# Altium schematic sheet THREE_PHASE_MODULE.SchDoc
size 457 x 304 mm; PageSetup: Record=PageOptions|CenterHorizontal=True|CenterVertical=True|PrintScale=0.68|XCorrection=1.00|YCorrection=1.00|PrintKind=1|BorderSize=5000000|LeftOffset=0|BottomOffset=0|Orientation=2|PaperLength=1000|PaperWidth=1000|Scale=100|PaperSource=7|PrintQuality=600|MediaType=1|DitherType=10|PaperKind=A4|PrintScaleMode=1
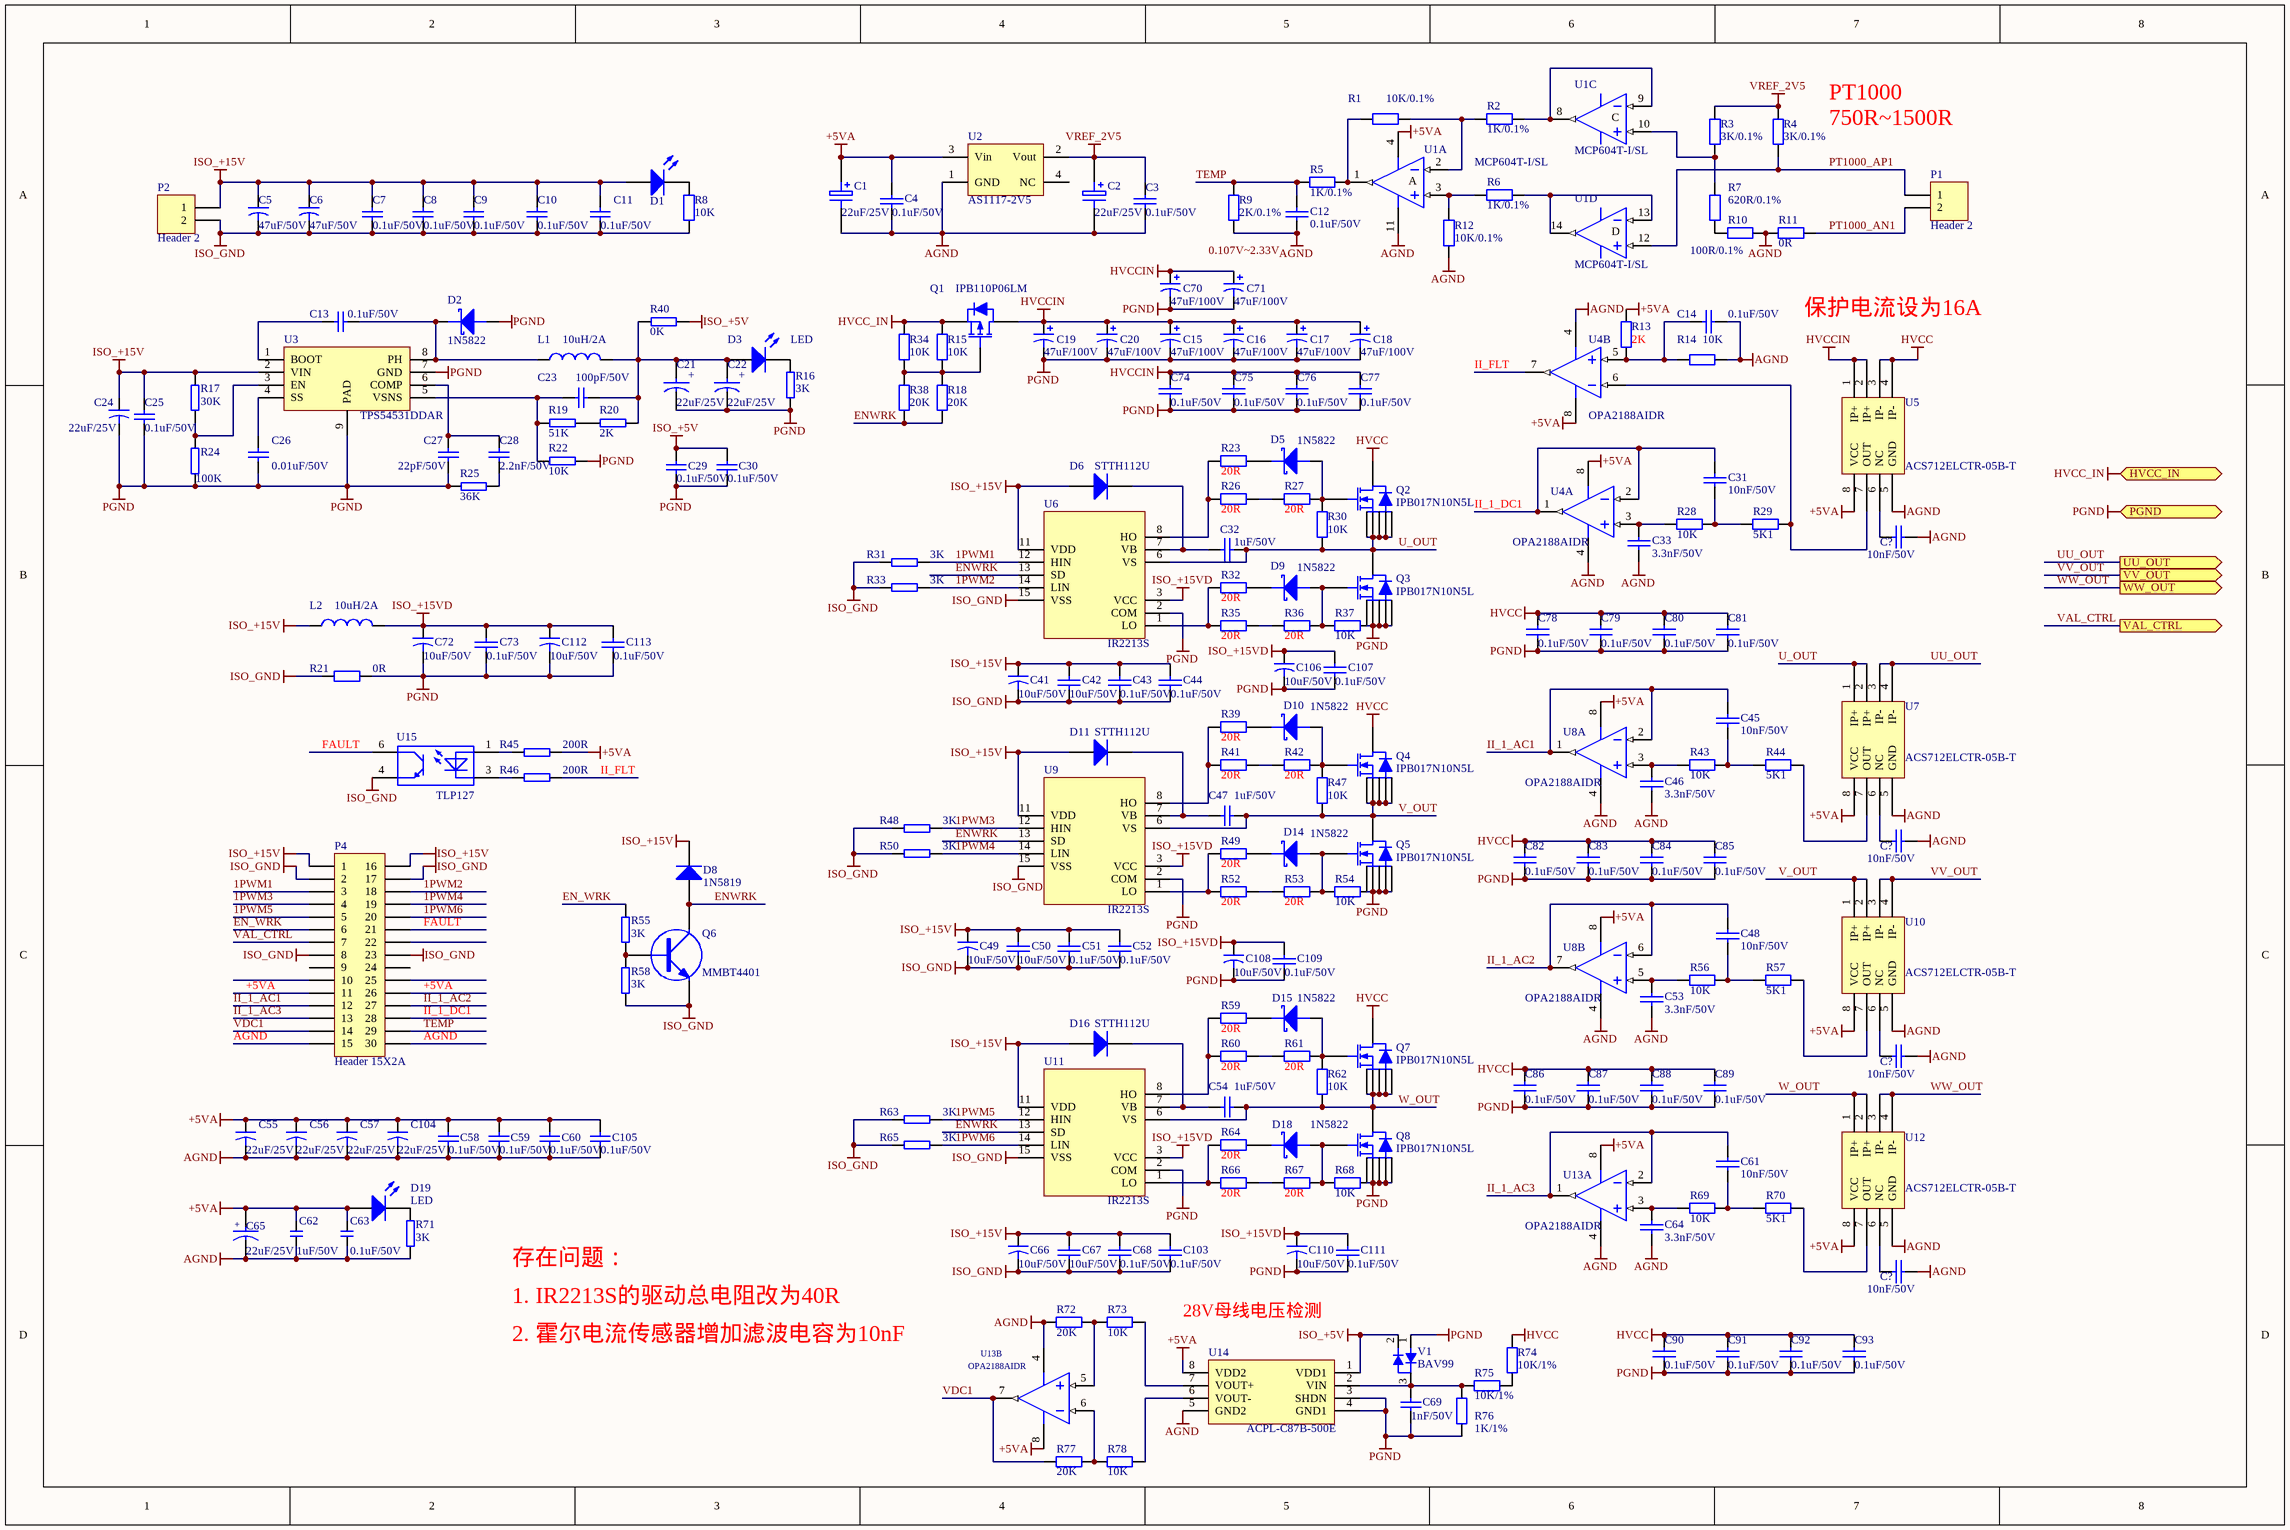
[diagram p0: THREE_PHASE_MODULE.SchDoc]

## Parts
(Parts that share a designator on the sheet are numbered #1, #2 ... from top to bottom, then left to right.)
C1  22uF/25V  [WP_1206CC]
C2  22uF/25V  [WP_1206CC]
C3  0.1uF/50V  [WP_0805C]
C4  0.1uF/50V  [WP_0805C]
C5  47uF/50V  [WP_1210CC]
C6  47uF/50V  [WP_1210CC]
C7  0.1uF/50V  [WP_0805C]
C8  0.1uF/50V  [WP_0805C]
C9  0.1uF/50V  [WP_0805C]
C10  0.1uF/50V  [WP_0805C]
C11  0.1uF/50V  [WP_0805C]
C12  0.1uF/50V  [WP_0805C]
C13  0.1uF/50V  [WP_0805C]
C14  0.1uF/50V  [WP_0805C]
C15  47uF/100V  [WP_1210CC]
C16  47uF/100V  [WP_1210CC]
C17  47uF/100V  [WP_1210CC]
C18  47uF/100V  [WP_1210CC]
C19  47uF/100V  [WP_1210CC]
C20  47uF/100V  [WP_1210CC]
C21  22uF/25V  [WP_1206CC]
C22  22uF/25V  [WP_1206CC]
C23  100pF/50V  [WP_0805C]
C24  22uF/25V  [WP_1206CC]
C25  0.1uF/50V  [WP_0805C]
C26  0.01uF/50V  [WP_0805C]
C27  22pF/50V  [WP_0805C]
C28  2.2nF/50V  [WP_0805C]
C29  0.1uF/50V  [WP_0805C]
C30  0.1uF/50V  [WP_0805C]
C31  10nF/50V  [WP_0805C]
C32  1uF/50V  [WP_0805C]
C33  3.3nF/50V  [WP_0805C]
C41  10uF/50V  [WP_1206CC]
C42  10uF/50V  [WP_1206CC]
C43  0.1uF/50V  [WP_0805C]
C44  0.1uF/50V  [WP_0805C]
C45  10nF/50V  [WP_0805C]
C46  3.3nF/50V  [WP_0805C]
C47  value 1uF/50V  [WP_0805C]  (hidden comment: Cap Semi)
C48  10nF/50V  [WP_0805C]
C49  10uF/50V  [WP_1206CC]
C50  10uF/50V  [WP_1206CC]
C51  0.1uF/50V  [WP_0805C]
C52  0.1uF/50V  [WP_0805C]
C53  3.3nF/50V  [WP_0805C]
C54  value 1uF/50V  [WP_0805C]  (hidden comment: Cap Semi)
C55  22uF/25V  [WP_1206CC]
C56  22uF/25V  [WP_1206CC]
C57  22uF/25V  [WP_1206CC]
C58  0.1uF/50V  [WP_0805C]
C59  0.1uF/50V  [WP_0805C]
C60  0.1uF/50V  [WP_0805C]
C61  10nF/50V  [WP_0805C]
C62  1uF/50V  [WP_0805C]
C63  0.1uF/50V  [WP_0805C]
C64  3.3nF/50V  [WP_0805C]
C65  22uF/25V  [WP_1206CC]
C66  10uF/50V  [WP_1206CC]
C67  10uF/50V  [WP_1206CC]
C68  0.1uF/50V  [WP_0805C]
C69  1nF/50V  [WP_0805C]
C70  47uF/100V  [WP_1210CC]
C71  47uF/100V  [WP_1210CC]
C72  10uF/50V  [WP_1206CC]
C73  0.1uF/50V  [WP_0805C]
C74  0.1uF/50V  [WP_0805C]
C75  0.1uF/50V  [WP_0805C]
C76  0.1uF/50V  [WP_0805C]
C77  0.1uF/50V  [WP_0805C]
C78  0.1uF/50V  [WP_0805C]
C79  0.1uF/50V  [WP_0805C]
C80  0.1uF/50V  [WP_0805C]
C81  0.1uF/50V  [WP_0805C]
C82  0.1uF/50V  [WP_0805C]
C83  0.1uF/50V  [WP_0805C]
C84  0.1uF/50V  [WP_0805C]
C85  0.1uF/50V  [WP_0805C]
C86  0.1uF/50V  [WP_0805C]
C87  0.1uF/50V  [WP_0805C]
C88  0.1uF/50V  [WP_0805C]
C89  0.1uF/50V  [WP_0805C]
C90  0.1uF/50V  [WP_0805C]
C91  0.1uF/50V  [WP_0805C]
C92  0.1uF/50V  [WP_0805C]
C93  0.1uF/50V  [WP_0805C]
C103  0.1uF/50V  [WP_0805C]
C104  22uF/25V  [WP_1206CC]
C105  0.1uF/50V  [WP_0805C]
C106  10uF/50V  [WP_1206CC]
C107  0.1uF/50V  [WP_0805C]
C108  10uF/50V  [WP_1206CC]
C109  0.1uF/50V  [WP_0805C]
C110  10uF/50V  [WP_1206CC]
C111  0.1uF/50V  [WP_0805C]
C112  10uF/50V  [WP_1206CC]
C113  0.1uF/50V  [WP_0805C]
C?#1  10nF/50V  [WP_0805C]
C?#2  10nF/50V  [WP_0805C]
C?#3  10nF/50V  [WP_0805C]
C?#4  10nF/50V  [WP_0805C]
D1  (no value)  [WP_0805_LED]
D2  1N5822  [WP_SMA_DO214AC]
D3  LED  [WP_0805_LED]
D5  1N5822  [WP_SMA_DO214AC]
D6  STTH112U  [WP_1812D]
D8  1N5819  [WP_SOD-323]
D9  1N5822  [WP_SMA_DO214AC]
D10  1N5822  [WP_SMA_DO214AC]
D11  STTH112U  [WP_1812D]
D14  1N5822  [WP_SMA_DO214AC]
D15  1N5822  [WP_SMA_DO214AC]
D16  STTH112U  [WP_1812D]
D18  1N5822  [WP_SMA_DO214AC]
D19  LED  [WP_0805_LED]
L1  10uH/2A  [WP_LBS6*6]
L2  10uH/2A  [WP_LBS6*6]
P1  Header 2  [WP_SIP2]
P2  Header 2  [WP_LSIP2]
P4  Header 15X2A  [WP_CRM222-030]
Q1  IPB110P06LM  [WP_TO263-3]
Q2  IPB017N10N5L  [JY_TO263-7]
Q3  IPB017N10N5L  [JY_TO263-7]
Q4  IPB017N10N5L  [JY_TO263-7]
Q5  IPB017N10N5L  [JY_TO263-7]
Q6  MMBT4401  [WP_SOT23B]
Q7  IPB017N10N5L  [JY_TO263-7]
Q8  IPB017N10N5L  [JY_TO263-7]
R1  10K/0.1%  [WP_0805R]
R2  1K/0.1%  [WP_0805R]
R3  3K/0.1%  [WP_0805R]
R4  3K/0.1%  [WP_0805R]
R5  1K/0.1%  [WP_0805R]
R6  1K/0.1%  [WP_0805R]
R7  620R/0.1%  [WP_0805R]
R8  10K  [WP_0805R]
R9  2K/0.1%  [WP_0805R]
R10  100R/0.1%  [WP_0805R]
R11  0R  [WP_0805R]
R12  10K/0.1%  [WP_0805R]
R13  2K  [WP_0805R]
R14  10K  [WP_0805R]
R15  10K  [WP_0805R]
R16  3K  [WP_0805R]
R17  30K  [WP_0805R]
R18  20K  [WP_0805R]
R19  51K  [WP_0805R]
R20  2K  [WP_0805R]
R21  0R  [WP_JS2L]
R22  10K  [WP_0805R]
R23  20R  [WP_0805R]
R24  100K  [WP_0805R]
R25  36K  [WP_0805R]
R26  20R  [WP_0805R]
R27  20R  [WP_0805R]
R28  10K  [WP_0805R]
R29  5K1  [WP_0805R]
R30  10K  [WP_0805R]
R31  3K  [WP_0805R]
R32  20R  [WP_0805R]
R33  3K  [WP_0805R]
R34  10K  [WP_0805R]
R35  20R  [WP_0805R]
R36  20R  [WP_0805R]
R37  10K  [WP_0805R]
R38  20K  [WP_0805R]
R39  20R  [WP_0805R]
R40  0K  [WP_0805R]
R41  20R  [WP_0805R]
R42  20R  [WP_0805R]
R43  10K  [WP_0805R]
R44  5K1  [WP_0805R]
R45  200R  [WP_0805R]
R46  200R  [WP_0805R]
R47  10K  [WP_0805R]
R48  3K  [WP_0805R]
R49  20R  [WP_0805R]
R50  3K  [WP_0805R]
R52  20R  [WP_0805R]
R53  20R  [WP_0805R]
R54  10K  [WP_0805R]
R55  3K  [WP_0805R]
R56  10K  [WP_0805R]
R57  5K1  [WP_0805R]
R58  3K  [WP_0805R]
R59  20R  [WP_0805R]
R60  20R  [WP_0805R]
R61  20R  [WP_0805R]
R62  10K  [WP_0805R]
R63  3K  [WP_0805R]
R64  20R  [WP_0805R]
R65  3K  [WP_0805R]
R66  20R  [WP_0805R]
R67  20R  [WP_0805R]
R68  10K  [WP_0805R]
R69  10K  [WP_0805R]
R70  5K1  [WP_0805R]
R71  3K  [WP_0805R]
R72  20K  [WP_0805R]
R73  10K  [WP_0805R]
R74  10K/1%  [WP_0805R]
R75  10K/1%  [WP_0805R]
R76  1K/1%  [WP_0805R]
R77  20K  [WP_0805R]
R78  10K  [WP_0805R]
U1  MCP604T-I/SL  [WP_SOIC14]  (parts A,C,D of 4)
U2  AS1117-2V5  [WP_SOT223]
U3  TPS54531DDAR  [WP_SOIC8P]
U4  OPA2188AIDR  [WP_SOIC8]  (parts A,B of 2)
U5  ACS712ELCTR-05B-T  [WP_SOIC8]
U6  IR2213S  [WP_SOIC16L]
U7  ACS712ELCTR-05B-T  [WP_SOIC8]
U8  OPA2188AIDR  [WP_SOIC8]  (parts A,B of 2)
U9  IR2213S  [WP_SOIC16L]
U10  ACS712ELCTR-05B-T  [WP_SOIC8]
U11  IR2213S  [WP_SOIC16L]
U12  ACS712ELCTR-05B-T  [WP_SOIC8]
U13  OPA2188AIDR  [WP_SOIC8]  (parts A,B of 2)
U14  ACPL-C87B-500E  [WP_SOIC8L]
U15  TLP127  [WP_SOP4]
V1  BAV99  [WP_SOT23B]

## Ports
HVCC_IN (in), PGND (in), UU_OUT (out), VAL_CTRL (out), VV_OUT (out), WW_OUT (out)

## Nets
+5VA: C1.1 C4.1 C55.1 C56.1 C57.1 C58.2 C59.2 C60.2 C62.1 C63.1 C65.1 C104.1 C105.2 D19.1(A) P4.11 P4.26 R13.2 R45.1 U1.4 U2.3(Vin) U4.8(V+) U5.8(VCC) U7.8(VCC) U8.8(V+) U10.8(VCC) U12.8(VCC) U13.8(V+) U14.8(VDD2)
AGND: C1.2 C2.2 C3.2 C4.2 C12.2 C14.2 C33.2 C46.2 C53.2 C55.2 C56.2 C57.2 C58.1 C59.1 C60.1 C62.2 C63.2 C64.2 C65.2 C104.2 C105.1 C?#1.1 C?#2.1 C?#3.1 C?#4.1 P4.15 P4.30 R9.1 R10.1 R11.2 R12.2 R14.1 R71.1 R72.2 U1.11 U2.1(GND) U4.4(V-) U5.5(GND) U7.5(GND) U8.4(V-) U10.5(GND) U12.5(GND) U13.4(V-) U14.5(GND2)
HVCC: C78.1 C79.1 C80.1 C81.1 C82.1 C83.1 C84.1 C85.1 C86.1 C87.1 C88.1 C89.1 C90.1 C91.1 C92.1 C93.1 Q2.4(D) Q4.4(D) Q7.4(D) R74.2 U5.3(IP-) U5.4(IP-)
HVCC_IN: Q1.3(S) R15.1 R34.1 ; port HVCC_IN
HVCCIN: C15.1 C16.1 C17.1 C18.1 C19.1 C20.1 C70.1 C71.1 C74.1 C75.1 C76.1 C77.1 Q1.2(D) U5.1(IP+) U5.2(IP+)
ISO_+5V: C29.2 C30.2 R40.2 U14.1(VDD1) V1.2(CATHODE)
ISO_+15V: C5.1 C6.1 C7.2 C8.2 C9.2 C10.2 C11.2 C24.1 C25.2 C41.1 C42.1 C43.1 C44.1 C49.1 C50.1 C51.1 C52.1 C66.1 C67.1 C68.1 C103.1 D1.1(A) D6.1(A) D8.2(K) D11.1(A) D16.1(A) L2.2 P2.1 P4.1 P4.16 R17.1 U3.2(VIN) U6.11(VDD) U9.11(VDD) U11.11(VDD)
ISO_+15VD: C72.1 C73.1 C106.1 C107.1 C108.1 C109.1 C110.1 C111.1 C112.1 C113.1 L2.1 U6.3(VCC) U9.3(VCC) U11.3(VCC)
ISO_GND: C5.2 C6.2 C7.1 C8.1 C9.1 C10.1 C11.1 C41.2 C42.2 C43.2 C44.2 C49.2 C50.2 C51.2 C52.2 C66.2 C67.2 C68.2 C103.2 P2.2 P4.2 P4.8 P4.17 P4.23 Q6.2(E) R8.1 R21.1 R31.2 R33.2 R48.2 R50.2 R58.1 R63.2 R65.2 U6.15(VSS) U9.15(VSS) U11.15(VSS) U15.4
PGND: C15.2 C16.2 C17.2 C18.2 C19.2 C20.2 C21.2 C22.2 C24.2 C25.1 C26.1 C27.1 C29.1 C30.1 C69.1 C70.2 C71.2 C72.2 C73.2 C74.2 C75.2 C76.2 C77.2 C78.2 C79.2 C80.2 C81.2 C82.2 C83.2 C84.2 C85.2 C86.2 C87.2 C88.2 C89.2 C90.2 C91.2 C92.2 C93.2 C106.2 C107.2 C108.2 C109.2 C110.2 C111.2 C112.2 C113.2 D2.1(A) Q3.2(S) Q3.3(S) Q3.5(S) Q3.6(S) Q3.7(S) Q5.2(S) Q5.3(S) Q5.5(S) Q5.6(S) Q5.7(S) Q8.2(S) Q8.3(S) Q8.5(S) Q8.6(S) Q8.7(S) R16.2 R21.2 R22.1 R24.2 R25.1 R37.1 R54.1 R68.1 R76.2 U3.7(GND) U3.9(PAD) U6.2(COM) U9.2(COM) U11.2(COM) U14.3(SHDN) U14.4(GND1) V1.1(ANODE) ; port PGND
VREF_2V5: C2.1 C3.1 R3.1 R4.1 U2.2(Vout)
1PWM1: P4.3 R31.1 U6.12(HIN)
1PWM2: P4.18 R33.1 U6.14(LIN)
1PWM3: P4.4 R48.1 U9.12(HIN)
1PWM4: P4.19 R50.1 U9.14(LIN)
1PWM5: P4.5 R63.1 U11.12(HIN)
1PWM6: P4.20 R65.1 U11.14(LIN)
EN_WRK: P4.6 R55.2
ENWRK: D8.1(A) Q6.3(C) R18.2 R38.2 U6.13(SD) U9.13(SD) U11.13(SD)
FAULT: P4.21 U15.6
II_1_AC1: C45.2 P4.12 U8.1(OUT1) U8.2(IN1-)
II_1_AC2: C48.2 P4.27 U8.6(IN2-) U8.7(OUT2)
II_1_AC3: C61.2 P4.13 U13.1(OUT1) U13.2(IN1-)
II_1_DC1: C31.2 P4.28 U4.1(OUT1) U4.2(IN1-)
II_FLT: R46.1 U4.7(OUT2)
PT1000_AN1: P1.2 R11.1
PT1000_AP1: P1.1 R4.2 U1.12(IN+)
TEMP: C12.1 P4.29 R5.2 R9.2
U_OUT: C32.2 Q2.2(S) Q2.3(S) Q2.5(S) Q2.6(S) Q2.7(S) Q3.4(D) R30.2 U6.6(VS) U7.1(IP+) U7.2(IP+)
UU_OUT: U7.3(IP-) U7.4(IP-) ; port UU_OUT
V_OUT: C47.1 Q4.2(S) Q4.3(S) Q4.5(S) Q4.6(S) Q4.7(S) Q5.4(D) R47.1 U9.6(VS) U10.1(IP+) U10.2(IP+)
VAL_CTRL: P4.7 ; port VAL_CTRL
VDC1: P4.14 R77.2 U13.7(OUT2)
VV_OUT: U10.3(IP-) U10.4(IP-) ; port VV_OUT
W_OUT: C54.1 Q7.2(S) Q7.3(S) Q7.5(S) Q7.6(S) Q7.7(S) Q8.4(D) R62.1 U11.6(VS) U12.1(IP+) U12.2(IP+)
WW_OUT: U12.3(IP-) U12.4(IP-) ; port WW_OUT
NetC13_1: C13.1 D2.2(K) L1.2 U3.8(PH)
NetC13_2: C13.2 U3.1(BOOT)
NetC14_1: C14.1 R13.1 R14.2 U4.5(IN2+)
NetC21_1: C21.1 C22.1 C23.1 D3.1(A) L1.1 R20.2 R40.1
NetC23_2: C23.2 R19.1 R22.2 U3.5(VSNS)
NetC26_2: C26.2 U3.4(SS)
NetC27_2: C27.2 C28.2 U3.6(COMP)
NetC28_1: C28.1 R25.2
NetC31_1: C31.1 R28.2 R29.1
NetC32_1: C32.1 D6.2(K) U6.7(VB)
NetC33_1: C33.1 R28.1 U4.3(IN1+)
NetC45_1: C45.1 R43.2 R44.1
NetC46_1: C46.1 R43.1 U8.3(IN1+)
NetC47_2: C47.2 D11.2(K) U9.7(VB)
NetC48_1: C48.1 R56.2 R57.1
NetC53_1: C53.1 R56.1 U8.5(IN2+)
NetC54_2: C54.2 D16.2(K) U11.7(VB)
NetC61_1: C61.1 R69.2 R70.1
NetC64_1: C64.1 R69.1 U13.3(IN1+)
NetC69_2: C69.2 R75.2 R76.1 U14.2(VIN) V1.3(CA)
NetC?#1_2: C?#1.2 U5.6(NC)
NetC?#2_2: C?#2.2 U7.6(NC)
NetC?#3_2: C?#3.2 U10.6(NC)
NetC?#4_2: C?#4.2 U12.6(NC)
NetD1_2: D1.2(K) R8.2
NetD3_2: D3.2(K) R16.1
NetD5_1: D5.1(A) Q2.1(G) R27.2 R30.1
NetD5_2: D5.2(K) R23.2
NetD9_1: D9.1(A) Q3.1(G) R36.2 R37.2
NetD9_2: D9.2(K) R32.2
NetD10_1: D10.1(A) Q4.1(G) R42.2 R47.2
NetD10_2: D10.2(K) R39.2
NetD14_1: D14.1(A) Q5.1(G) R53.2 R54.2
NetD14_2: D14.2(K) R49.2
NetD15_1: D15.1(A) Q7.1(G) R61.2 R62.2
NetD15_2: D15.2(K) R59.2
NetD18_1: D18.1(A) Q8.1(G) R67.2 R68.2
NetD18_2: D18.2(K) R64.2
NetD19_2: D19.2(K) R71.2
NetQ1_1: Q1.1(G) R15.2 R18.1 R34.2 R38.1
NetQ6_1: Q6.1(B) R55.1 R58.2
NetR1_1: R1.1 R5.1 U1.1(OUT)
NetR1_2: R1.2 R2.1 U1.2(IN-)
NetR2_2: R2.2 U1.8(OUT) U1.9(IN-)
NetR3_2: R3.2 R7.1 U1.10(IN+)
NetR6_1: R6.1 R12.1 U1.3(IN+)
NetR6_2: R6.2 U1.13(IN-) U1.14(OUT)
NetR7_2: R7.2 R10.2
NetR17_2: R17.2 R24.1 U3.3(EN)
NetR19_2: R19.2 R20.1
NetR23_1: R23.1 R26.1 U6.8(HO)
NetR26_2: R26.2 R27.1
NetR29_2: R29.2 U4.6(IN2-) U5.7(OUT)
NetR32_1: R32.1 R35.1 U6.1(LO)
NetR35_2: R35.2 R36.1
NetR39_1: R39.1 R41.1 U9.8(HO)
NetR41_2: R41.2 R42.1
NetR44_2: R44.2 U7.7(OUT)
NetR45_2: R45.2 U15.1
NetR46_2: R46.2 U15.3
NetR49_1: R49.1 R52.1 U9.1(LO)
NetR52_2: R52.2 R53.1
NetR57_2: R57.2 U10.7(OUT)
NetR59_1: R59.1 R60.1 U11.8(HO)
NetR60_2: R60.2 R61.1
NetR64_1: R64.1 R66.1 U11.1(LO)
NetR66_2: R66.2 R67.1
NetR70_2: R70.2 U12.7(OUT)
NetR72_1: R72.1 R73.2 U13.5(IN2+)
NetR73_1: R73.1 U14.7(VOUT+)
NetR74_1: R74.1 R75.1
NetR77_1: R77.1 R78.2 U13.6(IN2-)
NetR78_1: R78.1 U14.6(VOUT-)

Not connected (* = marked no-connect by the designer): P4 9 10 22 24 25; U2 4(NC)

## Notes on the sheet
- 28V母线电压检测
- Labels drawn without touching a wire or pin: 0.107V~2.33V, 1. IR2213S的驱动总电阻改为40R, 2. 霍尔电流传感器增加滤波电容为10nF, 750R~1500R, PT1000, 保护电流设为16A, 存在问题：
- (in symbol CAP1) +
- (in symbol TL084D, part A) A
- (in symbol TL084D, part C) C
- (in symbol TL084D, part D) D

## Library data of the parts
C1 C2 = ELECTRO1: Electrolytic Capacitor
C3 C4 C12 C14 C31-C33 C42-C46 C48 C50-C53 C61 C64 C67 C68 C73-C93 C103 C107 C109 C111 C113 C?#1-C?#4 = CAP: Capacitor
C5 C6 C24 C41 C49 C55-C57 C66 C72 C104 C106 C108 C110 C112 = Cap2: Capacitor; Published: 23-Sep-2002; Publisher: Altium Limited
C7-C11 C13 C23 C25 C29 C30 C47 C54 C58-C60 C69 C105 = Cap Semi: Capacitor (Semiconductor SIM Model); Published: 8-Jun-2000; Publisher: Altium Limited
  C7-C11 C13 C23 C25 C29 C30 C58-C60 C69 C105: Revision: July-2002: Re-released for DXP Platform.
  C47 C54: LatestRevisionDate: 29-May-2009; LatestRevisionNote: IPC-7351 Footprint Added.; PackageReference: C1206; PackageDescription: Chip Capacitor
C15-C20 C70 C71 = Cap Pol1: Polarized Capacitor (Radial); Value: 220uF/250V; Published: 8-Jun-2000; LatestRevisionDate: 17-Jul-2002; LatestRevisionNote: Re-released for DXP Platform.; PackageReference: RB7.6-15; Publisher: Altium Limited; PackageDescription: Polarized Capacitor (Radial); 2 Leads
C21 C22 C65 = CAP1
C26-C28 = Cap: Capacitor; Published: 8-Jun-2000; LatestRevisionDate: 17-Jul-2002; LatestRevisionNote: Re-released for DXP Platform.; PackageReference: RAD-0.3; Publisher: Altium Limited
C62 C63 = CAP
D1 = LED2: Published: 8-Jun-2000; LatestRevisionDate: 17-Jul-2002; LatestRevisionNote: Re-released for DXP Platform.; PackageDocument: Feb-2002; PackageReference: 3.2X1.6X1.1; Publisher: Altium Limited
D2 D5 D9 D10 D14 D15 D18 = DIODE SCHOTTKY: Schottky Diode
D3 D19 = LED0: Typical INFRARED GaAs LED; Published: 8-Jun-2000; LatestRevisionDate: 08-Jul-2005; LatestRevisionNote: Mech Layer 1 removed.; PackageReference: LED-0; Publisher: Altium Limited
D6 D8 D11 D16 = Diode: Default Diode; Published: 8-Jun-2000; LatestRevisionDate: 17-Jul-2002; LatestRevisionNote: Re-released for DXP Platform.; PackageDocument: Sep-1996; PackageReference: SMC; Publisher: Altium Limited; Code_JEDEC: DO-214-AB
L1 L2 = Inductor: Code_IEC: 1005; Value: 10mH; Published: 8-Jun-2000; LatestRevisionDate: 17-Jul-2002; LatestRevisionNote: Re-released for DXP Platform.; PackageReference: 0402-A; Publisher: Altium Limited; Code_JEITA: 0402
P1 P2 = Header 2: Header, 2-Pin; LatestRevisionDate: 17-Jul-2002; LatestRevisionNote: Re-released for DXP Platform.; Publisher: Altium Limited
P4 = Header 15X2A: Header, 15-Pin, Dual row; LatestRevisionDate: 17-Jul-2002; LatestRevisionNote: Re-released for DXP Platform.; Publisher: Altium Limited
Q1 = MOSFET-P: P-Channel MOSFET; Published: 8-Jun-2000; LatestRevisionDate: 17-Jul-2002; LatestRevisionNote: Re-released for DXP Platform.; PackageVersion: 1995/1996; PackageReference: E3; Publisher: Altium Limited; PackageDescription: TO, Flat Index; 3 In-Line, Axial Leads; Body Dia. 4.6mm; Lead Dia. 0.5 mm (max)
Q2-Q5 Q7 Q8 = IPB160N04S3-H2
R1-R15 R18 R21 R23 R26-R30 R32 R34-R39 R41-R44 R47 R49 R52-R54 R56 R57 R59-R62 R64 R66-R70 R72-R78 = Res2: Resistor; Published: 8-Jun-2000; Revision: July-2002: Re-released for DXP Platform.; Publisher: Altium Limited
R16 R17 R19 R20 R22 R24 R25 R31 R33 R40 R45 R46 R48 R50 R55 R58 R63 R65 R71 = RES
U1 = TL084D: JFET-Input Operational Amplifier; Package Information: Latest Revision: Jan-1998; Published: 16-Jan-2001; Revision: 17-Jul-2002: Re-released for DXP Platform.; Datasheet: Latest Revision: Feb-1999; Package Reference: D014; Publisher: Altium Limited
U2 = AS1117
U4 U8 U13 = LT1358: Fast Settling Dual Operational Amplifier
U5 U7 U10 U12 = ACS711
U15 = TLP521-1
V1 = BAV99: PUI: *; REF: *; REV: *; VAL: *; DESIG: *; BOI: *; TEN: *; FAB: *; DEV: *; Right: *; Bottom: *